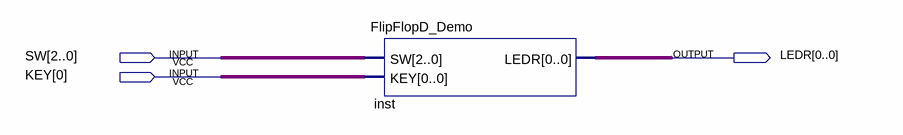
[diagram p0: schematic sheet]
// Quartus schematic flipflop.bdf as structural Verilog: 1 symbols, 3 pins
module flipflop (
  input  [2:0] SW,
  input  [0:0] KEY,
  output [0:0] LEDR
);

  FlipFlopD_Demo inst (.SW(SW), .KEY(KEY[0]), .LEDR(LEDR[0]));
endmodule
